# EAGLE schematic LEDBox (EAGLE 9.5.2)
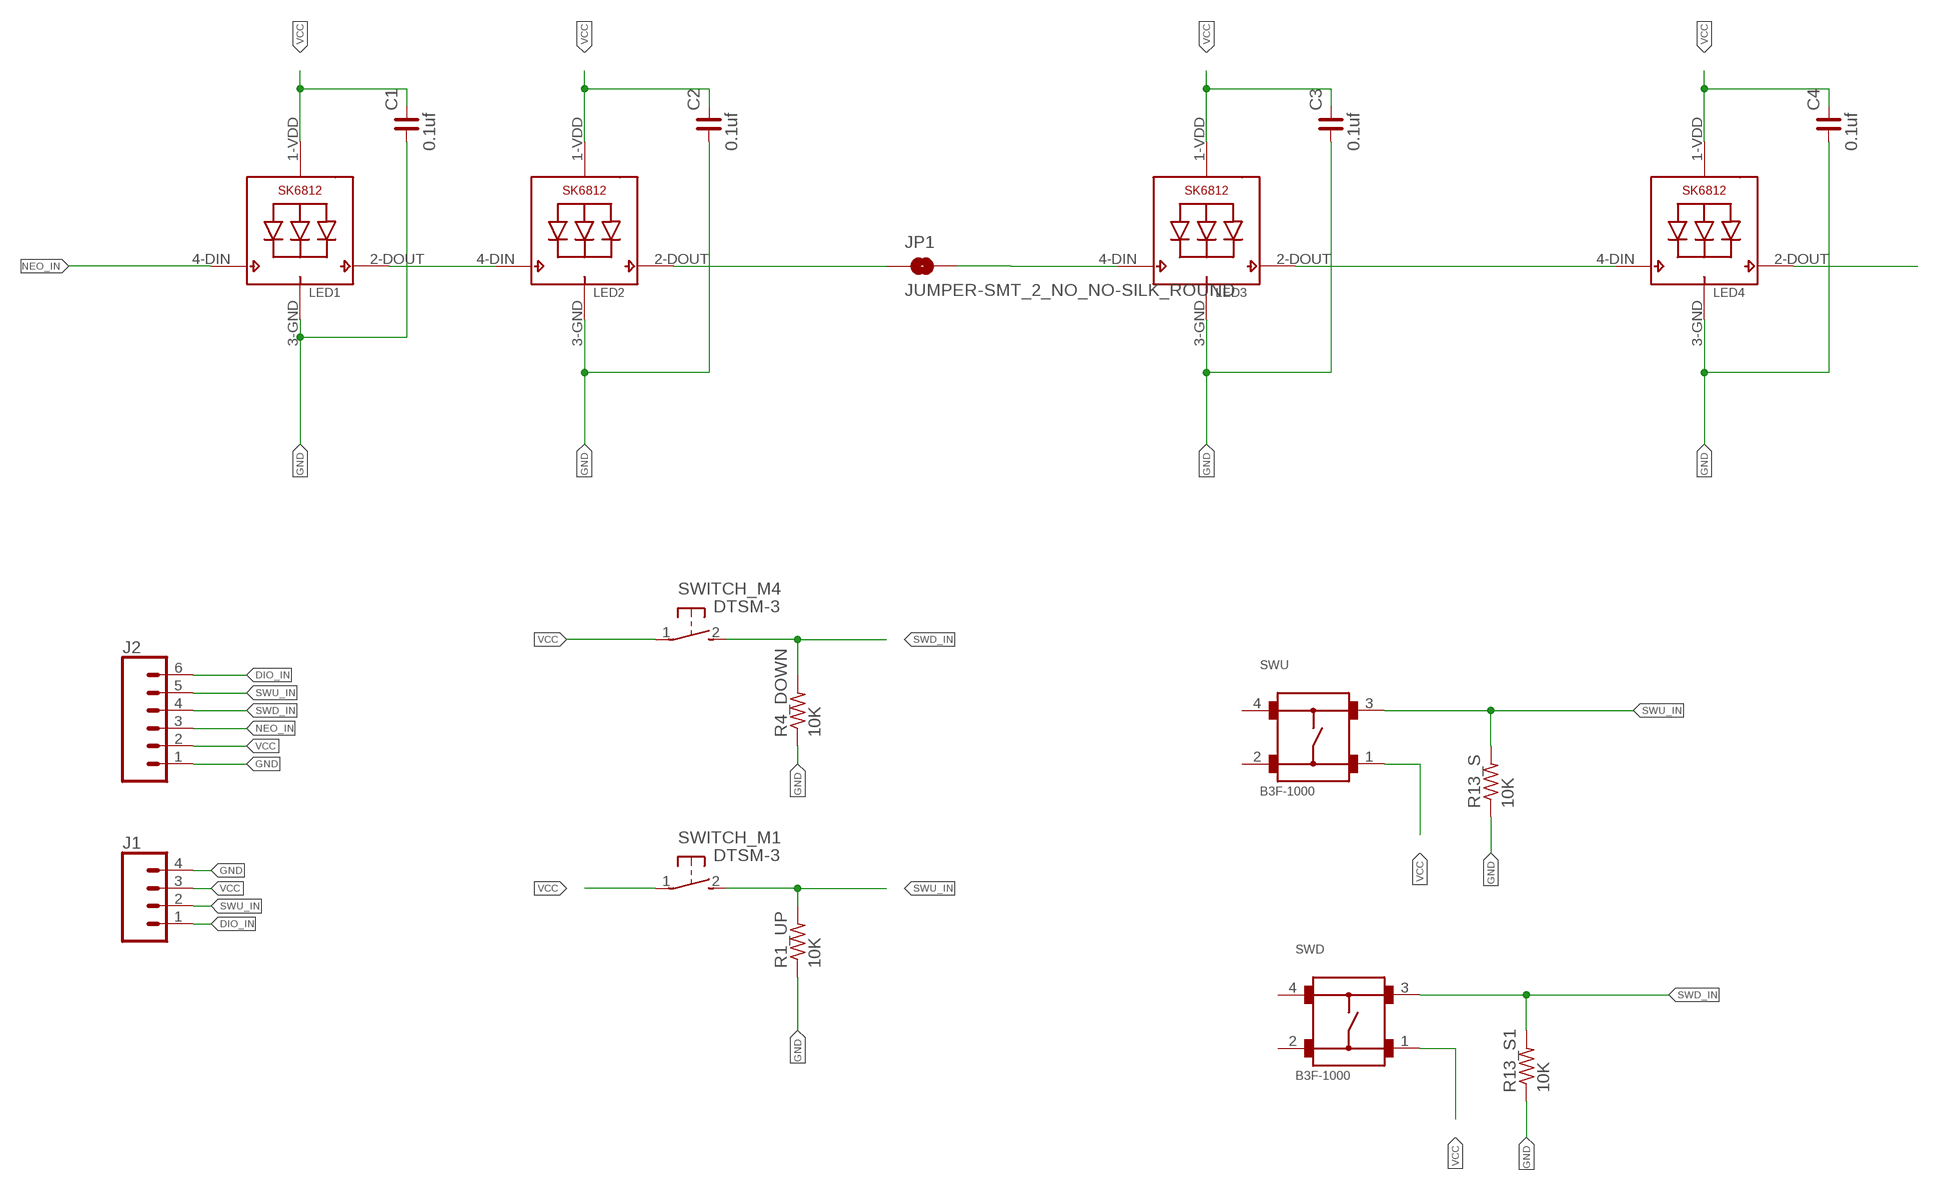
[diagram p0: schematic, sheet 1]

## Parts
C1  0.1uf  C_0805  [C0805]
C2  0.1uf  C_0805  [C0805]
C3  0.1uf  C_0805  [C0805]
C4  0.1uf  C_0805  [C0805]
J1  CONN_041X04_NO_SILK  [1X04_NO_SILK]
J2  CONN_06SMD-1MM  [1X06-1MM]
JP1  JUMPER-SMT_2_NO_NO-SILK_ROUND  [SMT-JUMPER_2_NO_NO-SILK_ROUND]
LED1  SK6812_5050W  [LED5050_W]
LED2  SK6812_5050W  [LED5050_W]
LED3  SK6812_5050W  [LED5050_W]
LED4  SK6812_5050W  [LED5050_W]
R1_UP  10K  R-US_M0805  [M0805]
R4_DOWN  10K  R-US_M0805  [M0805]
R13_S  10K  R-US_M0805  [M0805]
R13_S1  10K  R-US_M0805  [M0805]
SWD  B3F-1000  [B3F-1000]
SWITCH_M1  DTSM-3  [DTSM-3]
SWITCH_M4  DTSM-3  [DTSM-3]
SWU  B3F-1000  [B3F-1000]

## Nets
DIO_IN: J1.1 J2.6
GND: C1.1 C2.1 C3.1 C4.1 J1.4 J2.1 LED1.3-GND(GND) LED2.3-GND(GND) LED3.3-GND(GND) LED4.3-GND(GND) R1_UP.1 R4_DOWN.1 R13_S1.1 R13_S.1
N$1: LED1.2-DOUT(DO) LED2.4-DIN(DI)
N$2: JP1.1 LED2.2-DOUT(DO)
N$4: JP1.2 LED3.4-DIN(DI)
N$5: LED4.2-DOUT(DO)
N$6: LED3.2-DOUT(DO) LED4.4-DIN(DI)
NEO_IN: J2.3 LED1.4-DIN(DI)
SWD_IN: J2.4 R4_DOWN.2 R13_S1.2 SWD.3 SWITCH_M4.2
SWU_IN: J1.2 J2.5 R1_UP.2 R13_S.2 SWITCH_M1.2 SWU.3
VCC: C1.2 C2.2 C3.2 C4.2 J1.3 J2.2 LED1.1-VDD(VDD) LED2.1-VDD(VDD) LED3.1-VDD(VDD) LED4.1-VDD(VDD) SWD.1 SWITCH_M1.1 SWITCH_M4.1 SWU.1
Unconnected: SWD.2 SWD.4 SWU.2 SWU.4

## Library data of the parts
C1-C4 = rc-master-smd:C_: NON-POLARIZED CAP
J1 = SparkFun-Connectors:CONN_04: Multi connection point. Often used as Generic Header-pin footprint for 0.1 inch spaced/style header connections On any of the 0.1 inch spaced packages, you can populate with these: Break Away Headers - Straight <https://www.sparkfun.com/products/116> (PRT-00116) Break Away Male Headers - Right Angle <https://www.sparkfun.com/products/553> (PRT-00553) Female Headers <https://www.sparkfun.com/products/115> (PRT-00115) Break Away Headers - Machine Pin <https://www.sparkfun.com/products/117> (PRT-00117) Break Away Female Headers - Swiss Machine Pin <https://www.sparkfun.com/products/743> (PRT-00743) For SCREWTERMINALS and SPRING TERMINALS visit here: Screw Terimnals on SparkFun.com <https://www.sparkfun.com/search/results?term=Screw+Terminals> (5mm/3.5mm/2.54mm spacing) This device is also useful as a general connection point to wire up your design to another part of your project. Our various solder wires solder well into these plated through hole pads. Hook-Up Wire - Assortment (Stranded, 22 AWG) <https://www.sparkfun.com/products/11375> (PRT-11375) Hook-Up Wire - Assortment (Solid Core, 22 AWG) <https://www.sparkfun.com/products/11367> (PRT-11367) View the entire wire category on our website here <https://www.sparkfun.com/categories/141> Special notes: Molex polarized connector foot print use with SKU : PRT-08231 with associated crimp pins and housings. 1MM SMD Version SKU: PRT-10208; PROD_ID: CONN-09696
J2 = SparkFun-Connectors:CONN_06: Multi connection point. Often used as Generic Header-pin footprint for 0.1 inch spaced/style header connections On any of the 0.1 inch spaced packages, you can populate with these: Break Away Headers - Straight <https://www.sparkfun.com/products/116> (PRT-00116) Break Away Male Headers - Right Angle <https://www.sparkfun.com/products/553> (PRT-00553) Female Headers <https://www.sparkfun.com/products/115> (PRT-00115) Break Away Headers - Machine Pin <https://www.sparkfun.com/products/117> (PRT-00117) Break Away Female Headers - Swiss Machine Pin <https://www.sparkfun.com/products/743> (PRT-00743) Arduino Stackable Header - 6 Pin <https://www.sparkfun.com/products/9280> (PRT-09280) For SCREWTERMINALS and SPRING TERMINALS visit here: Screw Terimnals on SparkFun.com <https://www.sparkfun.com/search/results?term=Screw+Terminals> (5mm/3.5mm/2.54mm spacing) This device is also useful as a general connection point to wire up your design to another part of your project. Our various solder wires solder well into these plated through hole pads. Hook-Up Wire - Assortment (Stranded, 22 AWG) <https://www.sparkfun.com/products/11375> (PRT-11375) Hook-Up Wire - Assortment (Solid Core, 22 AWG) <https://www.sparkfun.com/products/11367> (PRT-11367) View the entire wire category on our website here <https://www.sparkfun.com/categories/141>; PROD_ID: CONN-08249; SF_ID: GPS-00579
JP1 = SparkFun-Jumpers:JUMPER-SMT_2_NO: Normally open jumper This jumper has two pads in close proximity to each other. Apply solder to close the connection. Round pads are easier to solder for beginners, but are a lot larger. SparkFun Product that uses the round pads: SparkFun EL Sequencer <https://www.sparkfun.com/products/12781>
LED1-LED4 = SK6812:SK6812
R1_UP R4_DOWN R13_S R13_S1 = resistor:R-US_: RESISTOR, American symbol
SWD SWU = Switch:B3F-1000: Tactile Switch SPST-NO Top Actuated Through Hole Manufacturer's datasheet <https://omronfs.omron.com/en_US/ecb/products/pdf/en-b3f.pdf>; CREATED_BY: PCBLayout.com; DIGI_KEY_PART_NUMBER: SW400-ND; MANUFACTURER: Omron Electronics Inc-EMC Div; MPN: B3F-1000; PACKAGE: SPST-NO
SWITCH_M1 SWITCH_M4 = switch-tact:DTSM-3

## Net classes
0 default: width 0.2 mm, clearance 0.2 mm